# Altium schematic sheet IRIS-EXT-04-BRK_GTX-Breakout.SchDoc
size A3
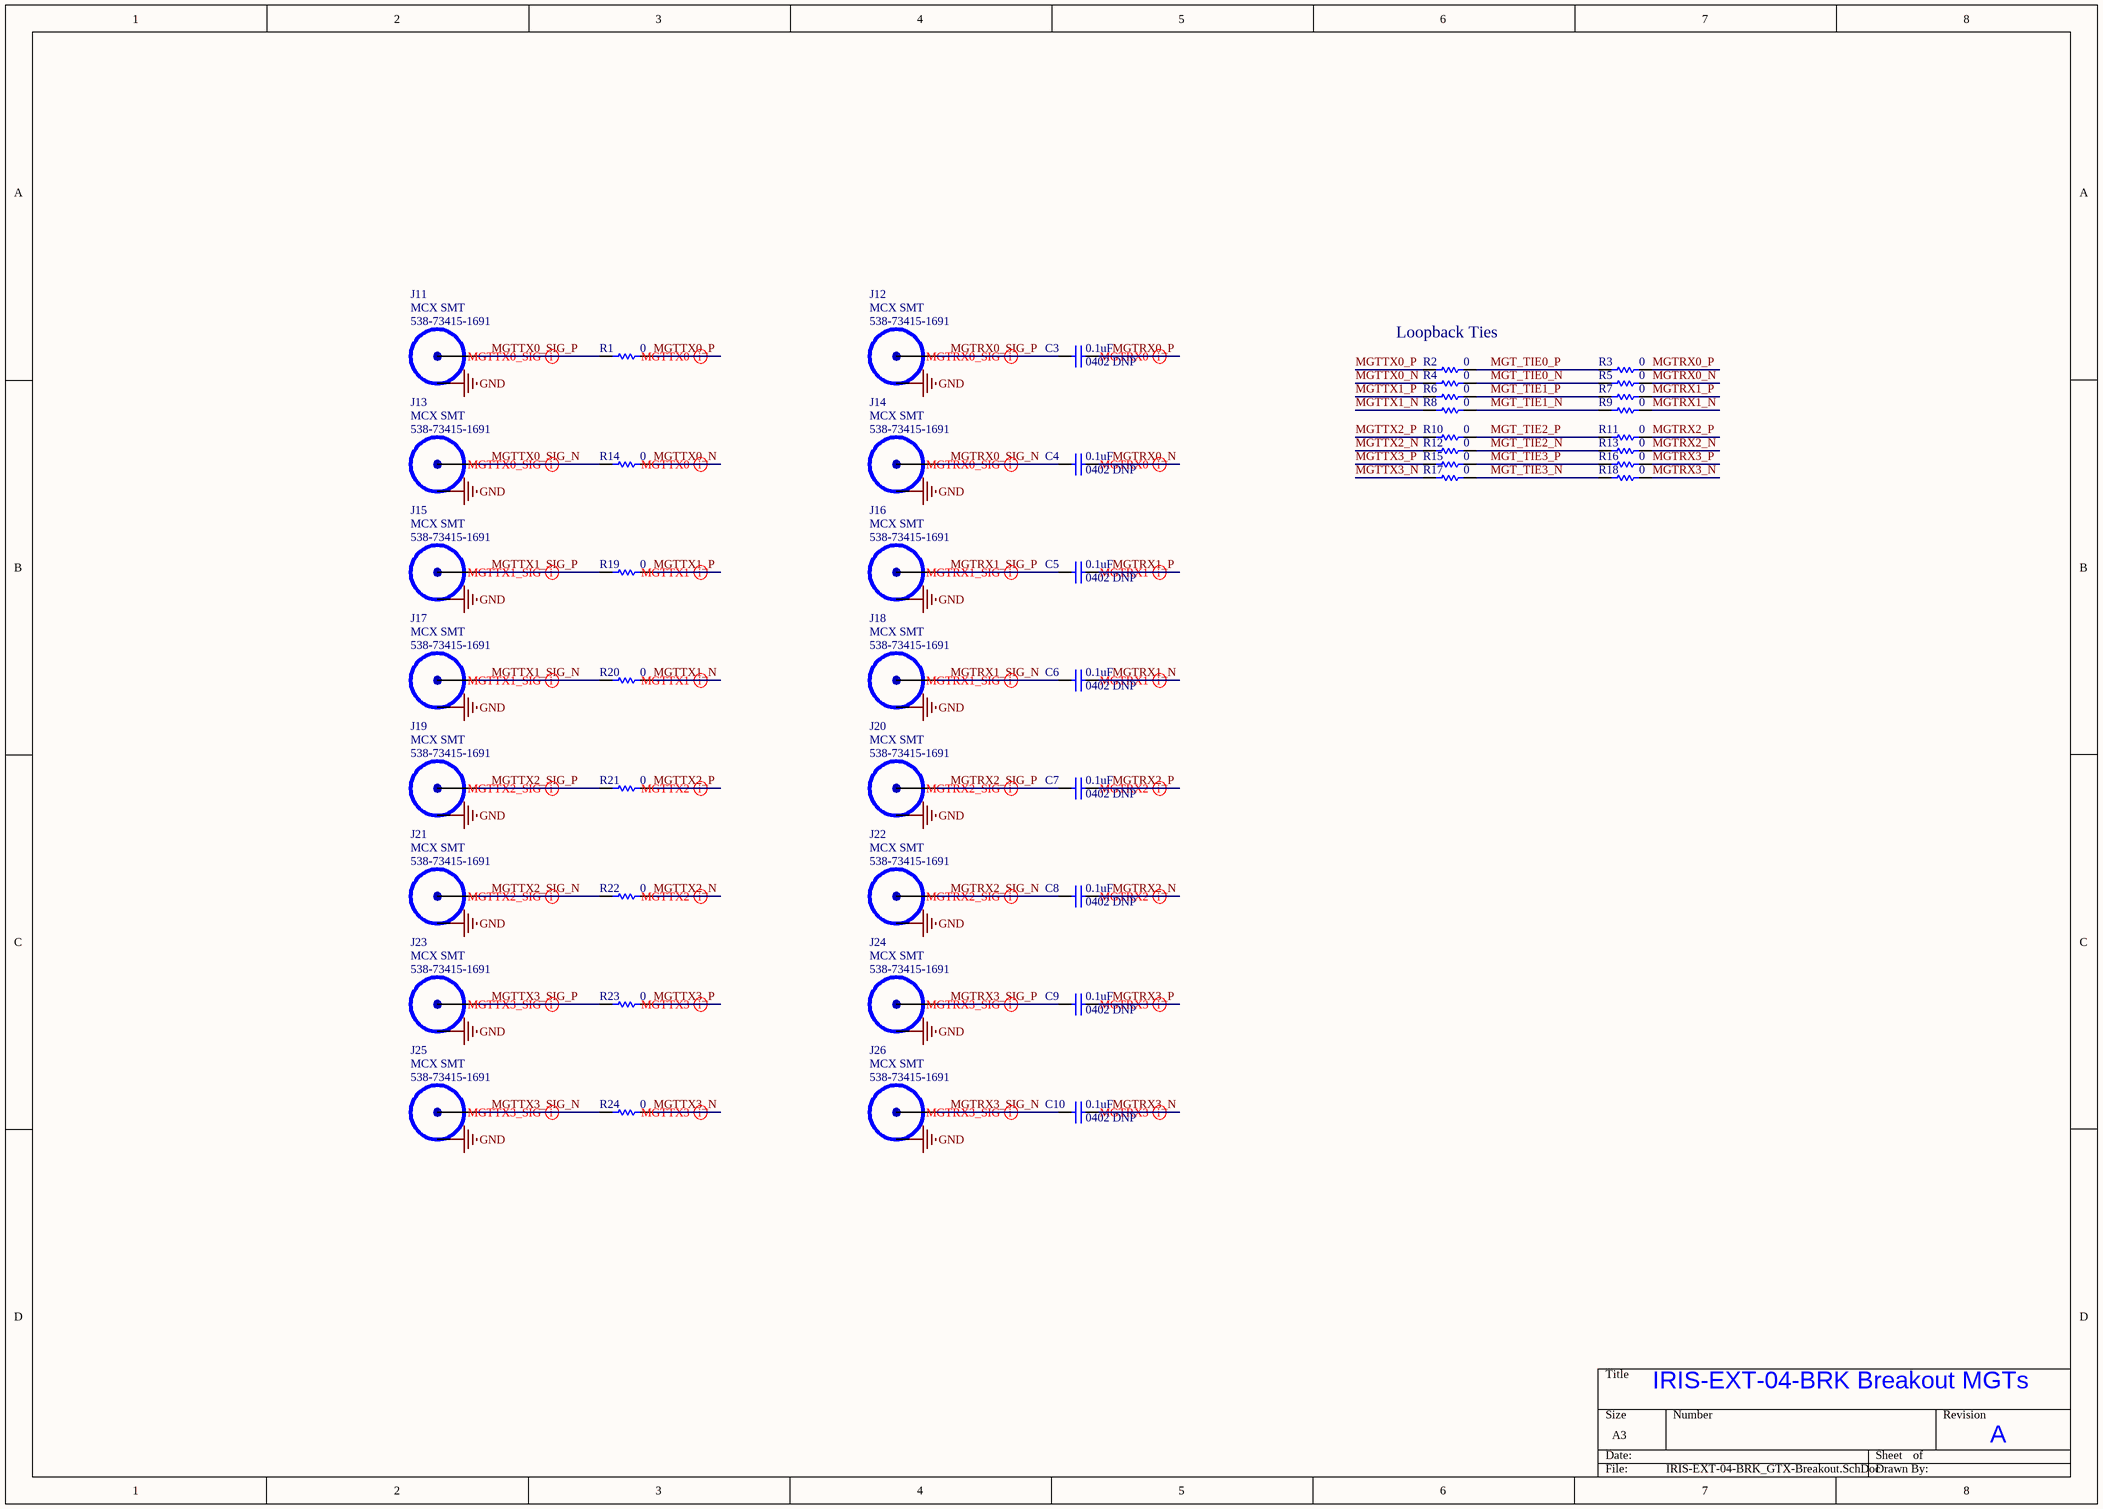
[diagram p0: IRIS-EXT-04-BRK_GTX-Breakout.SchDoc]

## Parts
C3  0402 DNP  value 0.1uF  [0402_SMT_CAP]
C4  0402 DNP  value 0.1uF  [0402_SMT_CAP]
C5  0402 DNP  value 0.1uF  [0402_SMT_CAP]
C6  0402 DNP  value 0.1uF  [0402_SMT_CAP]
C7  0402 DNP  value 0.1uF  [0402_SMT_CAP]
C8  0402 DNP  value 0.1uF  [0402_SMT_CAP]
C9  0402 DNP  value 0.1uF  [0402_SMT_CAP]
C10  0402 DNP  value 0.1uF  [0402_SMT_CAP]
J11  MCX SMT  Supplier Part Number 1: 538-73415-1691  [Molex-734151691]
J12  MCX SMT  Supplier Part Number 1: 538-73415-1691  [Molex-734151691]
J13  MCX SMT  Supplier Part Number 1: 538-73415-1691  [Molex-734151691]
J14  MCX SMT  Supplier Part Number 1: 538-73415-1691  [Molex-734151691]
J15  MCX SMT  Supplier Part Number 1: 538-73415-1691  [Molex-734151691]
J16  MCX SMT  Supplier Part Number 1: 538-73415-1691  [Molex-734151691]
J17  MCX SMT  Supplier Part Number 1: 538-73415-1691  [Molex-734151691]
J18  MCX SMT  Supplier Part Number 1: 538-73415-1691  [Molex-734151691]
J19  MCX SMT  Supplier Part Number 1: 538-73415-1691  [Molex-734151691]
J20  MCX SMT  Supplier Part Number 1: 538-73415-1691  [Molex-734151691]
J21  MCX SMT  Supplier Part Number 1: 538-73415-1691  [Molex-734151691]
J22  MCX SMT  Supplier Part Number 1: 538-73415-1691  [Molex-734151691]
J23  MCX SMT  Supplier Part Number 1: 538-73415-1691  [Molex-734151691]
J24  MCX SMT  Supplier Part Number 1: 538-73415-1691  [Molex-734151691]
J25  MCX SMT  Supplier Part Number 1: 538-73415-1691  [Molex-734151691]
J26  MCX SMT  Supplier Part Number 1: 538-73415-1691  [Molex-734151691]
R1  value 0  [0402_SMT_RES]  (hidden comment: 0402 DNP)
R2  value 0  [0603_SMT_RES]  (hidden comment: 0603)
R3  value 0  [0603_SMT_RES]  (hidden comment: 0603)
R4  value 0  [0603_SMT_RES]  (hidden comment: 0603)
R5  value 0  [0603_SMT_RES]  (hidden comment: 0603)
R6  value 0  [0603_SMT_RES]  (hidden comment: 0603)
R7  value 0  [0603_SMT_RES]  (hidden comment: 0603)
R8  value 0  [0603_SMT_RES]  (hidden comment: 0603)
R9  value 0  [0603_SMT_RES]  (hidden comment: 0603)
R10  value 0  [0603_SMT_RES]  (hidden comment: 0603)
R11  value 0  [0603_SMT_RES]  (hidden comment: 0603)
R12  value 0  [0603_SMT_RES]  (hidden comment: 0603)
R13  value 0  [0603_SMT_RES]  (hidden comment: 0603)
R14  value 0  [0402_SMT_RES]  (hidden comment: 0402 DNP)
R15  value 0  [0603_SMT_RES]  (hidden comment: 0603)
R16  value 0  [0603_SMT_RES]  (hidden comment: 0603)
R17  value 0  [0603_SMT_RES]  (hidden comment: 0603)
R18  value 0  [0603_SMT_RES]  (hidden comment: 0603)
R19  value 0  [0402_SMT_RES]  (hidden comment: 0402 DNP)
R20  value 0  [0402_SMT_RES]  (hidden comment: 0402 DNP)
R21  value 0  [0402_SMT_RES]  (hidden comment: 0402 DNP)
R22  value 0  [0402_SMT_RES]  (hidden comment: 0402 DNP)
R23  value 0  [0402_SMT_RES]  (hidden comment: 0402 DNP)
R24  value 0  [0402_SMT_RES]  (hidden comment: 0402 DNP)

## Nets
GND: J11.0(GND) J12.0(GND) J13.0(GND) J14.0(GND) J15.0(GND) J16.0(GND) J17.0(GND) J18.0(GND) J19.0(GND) J20.0(GND) J21.0(GND) J22.0(GND) J23.0(GND) J24.0(GND) J25.0(GND) J26.0(GND)
MGT_TIE0_N: R4.1 R5.2
MGT_TIE0_P: R2.1 R3.2
MGT_TIE1_N: R8.1 R9.2
MGT_TIE1_P: R6.1 R7.2
MGT_TIE2_N: R12.1 R13.2
MGT_TIE2_P: R10.1 R11.2
MGT_TIE3_N: R17.1 R18.2
MGT_TIE3_P: R15.1 R16.2
MGTRX0_N: C4.1 R5.1
MGTRX0_P: C3.1 R3.1
MGTRX0_SIG_N: C4.2 J14.1(SIG)
MGTRX0_SIG_P: C3.2 J12.1(SIG)
MGTRX1_N: C6.1 R9.1
MGTRX1_P: C5.1 R7.1
MGTRX1_SIG_N: C6.2 J18.1(SIG)
MGTRX1_SIG_P: C5.2 J16.1(SIG)
MGTRX2_N: C8.1 R13.1
MGTRX2_P: C7.1 R11.1
MGTRX2_SIG_N: C8.2 J22.1(SIG)
MGTRX2_SIG_P: C7.2 J20.1(SIG)
MGTRX3_N: C10.1 R18.1
MGTRX3_P: C9.1 R16.1
MGTRX3_SIG_N: C10.2 J26.1(SIG)
MGTRX3_SIG_P: C9.2 J24.1(SIG)
MGTTX0_N: R4.2 R14.2
MGTTX0_P: R1.2 R2.2
MGTTX0_SIG_N: J13.1(SIG) R14.1
MGTTX0_SIG_P: J11.1(SIG) R1.1
MGTTX1_N: R8.2 R20.2
MGTTX1_P: R6.2 R19.2
MGTTX1_SIG_N: J17.1(SIG) R20.1
MGTTX1_SIG_P: J15.1(SIG) R19.1
MGTTX2_N: R12.2 R22.2
MGTTX2_P: R10.2 R21.2
MGTTX2_SIG_N: J21.1(SIG) R22.1
MGTTX2_SIG_P: J19.1(SIG) R21.1
MGTTX3_N: R17.2 R24.2
MGTTX3_P: R15.2 R23.2
MGTTX3_SIG_N: J25.1(SIG) R24.1
MGTTX3_SIG_P: J23.1(SIG) R23.1

## Layout directives
differential pair: MGTRX0_N, MGTRX0_P, MGTRX0_SIG_N, MGTRX0_SIG_P, MGTRX1_N, MGTRX1_P, MGTRX1_SIG_N, MGTRX1_SIG_P, MGTRX2_N, MGTRX2_P, MGTRX2_SIG_N, MGTRX2_SIG_P, MGTRX3_N, MGTRX3_P, MGTRX3_SIG_N, MGTRX3_SIG_P, MGTTX0_N, MGTTX0_P, MGTTX0_SIG_N, MGTTX0_SIG_P, MGTTX1_N, MGTTX1_P, MGTTX1_SIG_N, MGTTX1_SIG_P, MGTTX2_N, MGTTX2_P, MGTTX2_SIG_N, MGTTX2_SIG_P, MGTTX3_N, MGTTX3_P, MGTTX3_SIG_N, MGTTX3_SIG_P

## Notes on the sheet
- Loopback Ties
- IRIS-EXT-04-BRK Breakout MGTs
- A

## Library data of the parts
C3-C10 = Cap_0402: 0402 SMT Capacitor; Supplier 1: Mouser; Supplier Part Number 1: 81-GRM155R71C104JA8D
J11-J26 = Molex-734151691: Molex 50 Ohm SMT MCX Jack; Supplier 1: Mouser
R1 R14 R19-R24 = Res_0402: 0402 SMT Resistor; Supplier 1: Mouser; Supplier Part Number 1: 667-ERJ-2GE0R00X
R2-R13 R15-R18 = Res_0603: 0603 SMT Resistor; Supplier 1: Mouser; Supplier Part Number 1: 667-ERJ-3GEY0R00V; Supplier 2: Digi-Key; Supplier Part Number 2: P0.0GCT-ND; ClassName: NoCollide